# EAGLE design Soccer-Robot V1.2 (EAGLE 9.5.1)

## Sheet 1 of 2
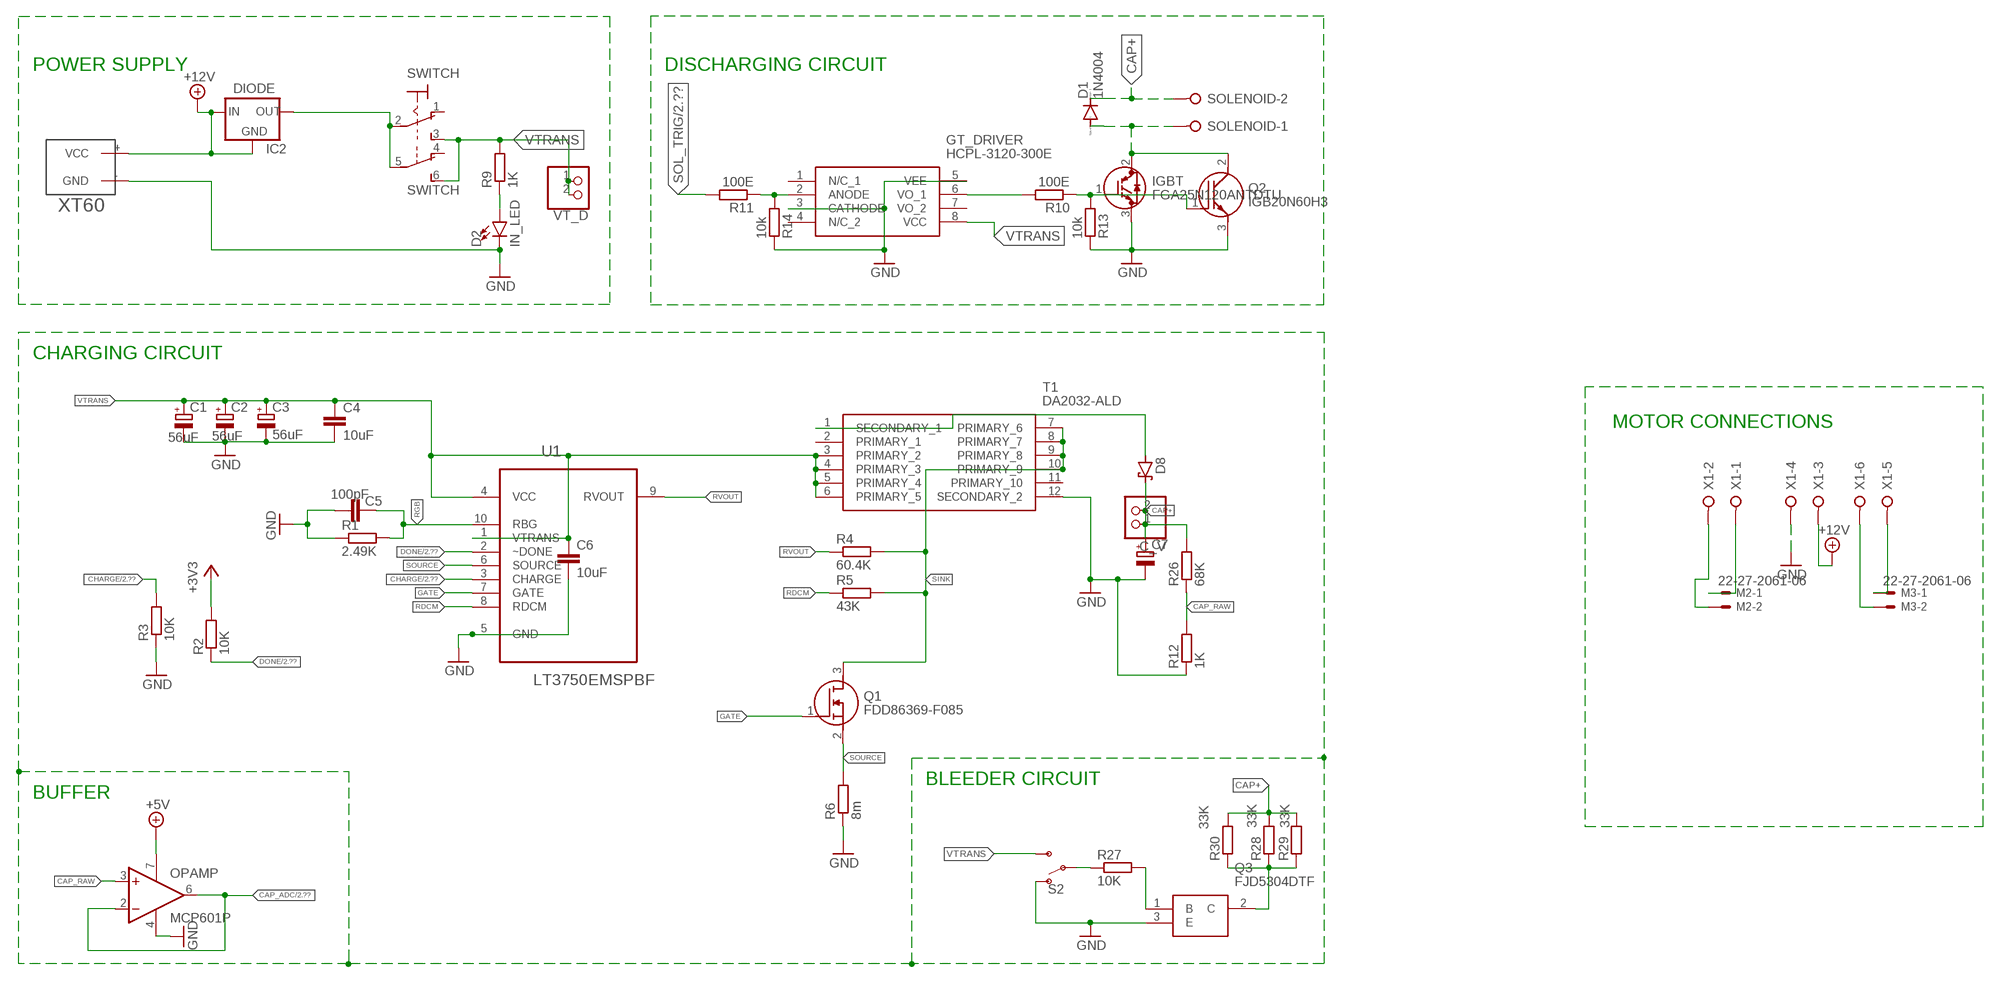
[diagram p0: schematic, sheet 1]

### Parts
C1  56uF  CPOL-EUE2.5-5  [E2,5-5]
C2  56uF  CPOL-EUE2.5-5  [E2,5-5]
C3  56uF  CPOL-EUE2.5-5  [E2,5-5]
C4  10uF  C-EUC1206  [C1206]
C5  100pF  C-EUC1206  [C1206]
C6  10uF  C-EUC1206  [C1206]
C7  CPOL-EUE10-30  [EB30D]
C_V  PINHD-1X2  [1X02]
D1  1N4004  [DO41-10]
D2  IN_LED  LED5MM  [LED_5MM]
D8  SCHOTTKY-DIODESMC  [SMC]
GT_DRIVER  HCPL-3120-300E  [HCPL-3120-GULL-WING]
IC2  DIODE  LM1117TO252  [TO252]
IGBT  FGA25N120ANTDTU  [TO545P500X1560X2420-3P]
M2  22-27-2061-06  [6410-06]
M3  22-27-2061-06  [6410-06]
OPAMP  MCP601P  [DIL08]
Q1  FDD86369-F085  [DPAK3-CASE-369AS]
Q2  IGB20N60H3  [IDB30E60]
Q3  FJD5304DTF  [FJD5304DTF]
R1  2.49K  R-EU_M1206  [M1206]
R2  10K  R-EU_M1206  [M1206]
R3  10K  R-EU_M1206  [M1206]
R4  60.4K  R-EU_M1206  [M1206]
R5  43K  R-EU_M1206  [M1206]
R6  8m  R-EU_M1206  [M1206]
R9  1K  R-EU_M1206  [M1206]
R10  100E  R-EU_M1206  [M1206]
R11  100E  R-EU_M1206  [M1206]
R12  1K  R-EU_M1206  [M1206]
R13  10k  R-EU_M1206  [M1206]
R14  10k  R-EU_M1206  [M1206]
R26  68K  R-EU_M1206  [M1206]
R27  10K  R-EU_M1206  [M1206]
R28  33K  R-EU_M1206  [M1206]
R29  33K  R-EU_M1206  [M1206]
R30  33K  R-EU_M1206  [M1206]
S2  SWITCH-SPDT-PTH-11.6X4.0MM  [SWITCH_SPDT_PTH_11.6X4.0MM]
SOLENOID  W237-02P  [W237-132]
SWITCH  320-938  [320-938]
T1  DA2032-ALD  [SOP250P2197X889-12N]
U1  LT3750EMSPBF  [SOP50P490X110-10N]
U$1  XT60  [XT60]
VT_D  PINHD-1X2  [1X02]
X1  W237-06P  [W237-6P]

### Nets
+3V3: R2.2 ; also sheet 2
+5V: OPAMP.7(V+) ; also sheet 2
+12V: IC2.1(GND) IC2.2(IN) U$1.+(VCC) X1.3 ; also sheet 2
CAP+: C7.+ C_V.1 C_V.2 D1.C D8.C R26.2 R28.2 R29.2 R30.2 SOLENOID.2
CAP_ADC: OPAMP.2(-IN) OPAMP.6(OUT) ; also sheet 2
CAP_RAW: OPAMP.3(+IN) R12.2 R26.1
CHARGE: R3.2 U1.3(CHARGE) ; also sheet 2
DONE: R2.1 U1.2(~DONE) ; also sheet 2
GATE: Q1.1(G) U1.7(GATE)
GND: C1.- C2.- C3.- C4.2 C5.2 C6.2 C7.- D2.K(C) GT_DRIVER.3(CATHODE) GT_DRIVER.5(VEE) IGBT.3(E) OPAMP.4(V-) Q2.3(E) Q3.3(E) R1.1 R3.1 R6.1 R12.1 R13.2 R14.2 S2.1(O) T1.12(SECONDARY_2) U1.5(GND) U$1.-(GND) X1.4 ; also sheet 2
N$2: R27.1 S2.2(P)
N$3: Q3.1(B) R27.2
N$4: D8.A T1.1(SECONDARY_1)
N$7: D2.A R9.1
N$8: IGBT.1(G) Q2.1(G) R10.1 R13.1
N$9: GT_DRIVER.6(VO_1) R10.2
N$10: D1.A IGBT.2(C) Q2.2(C) SOLENOID.1
N$11: GT_DRIVER.2(ANODE) R11.1 R14.1
N$13: M3.1 X1.5
N$15: M3.2 X1.6
N$16: M2.2 X1.2
N$17: M2.1 X1.1
N$23: Q3.2(C) R28.1 R29.1 R30.1
RDCM: R5.1 U1.8(RDCM)
RGB: C5.1 R1.2 U1.10(RBG)
RVOUT: R4.1 U1.9(RVOUT)
SINK: Q1.3(D) R4.2 R5.2 T1.7(PRIMARY_6) T1.8(PRIMARY_7) T1.9(PRIMARY_8) T1.10(PRIMARY_9)
SOL_TRIG: R11.2 ; also sheet 2
SOURCE: Q1.2(S) R6.2 U1.6(SOURCE)
VIN: IC2.3(OUT) SWITCH.2(1:P) SWITCH.5(B:P)
VTRANS: C1.+ C2.+ C3.+ C4.1 C6.1 GT_DRIVER.8(VCC) R9.2 S2.3(S) SWITCH.3(1:S) SWITCH.6(B:S) T1.3(PRIMARY_2) T1.4(PRIMARY_3) T1.5(PRIMARY_4) T1.6(PRIMARY_5) U1.1(VTRANS) U1.4(VCC) VT_D.1 VT_D.2
Unconnected: GT_DRIVER.1(N/C_1) GT_DRIVER.4(N/C_2) GT_DRIVER.7(VO_2) M2.3 M2.4 M2.5 M2.6 M3.3 M3.4 M3.5 M3.6 SWITCH.1(1:O) SWITCH.4(B:O) T1.2(PRIMARY_1) T1.11(PRIMARY_10)

### Notes on the sheet
- POWER SUPPLY | DISCHARGING CIRCUIT
- CHARGING CIRCUIT
- MOTOR CONNECTIONS
- BLEEDER CIRCUIT
- BUFFER

## Sheet 2 of 2
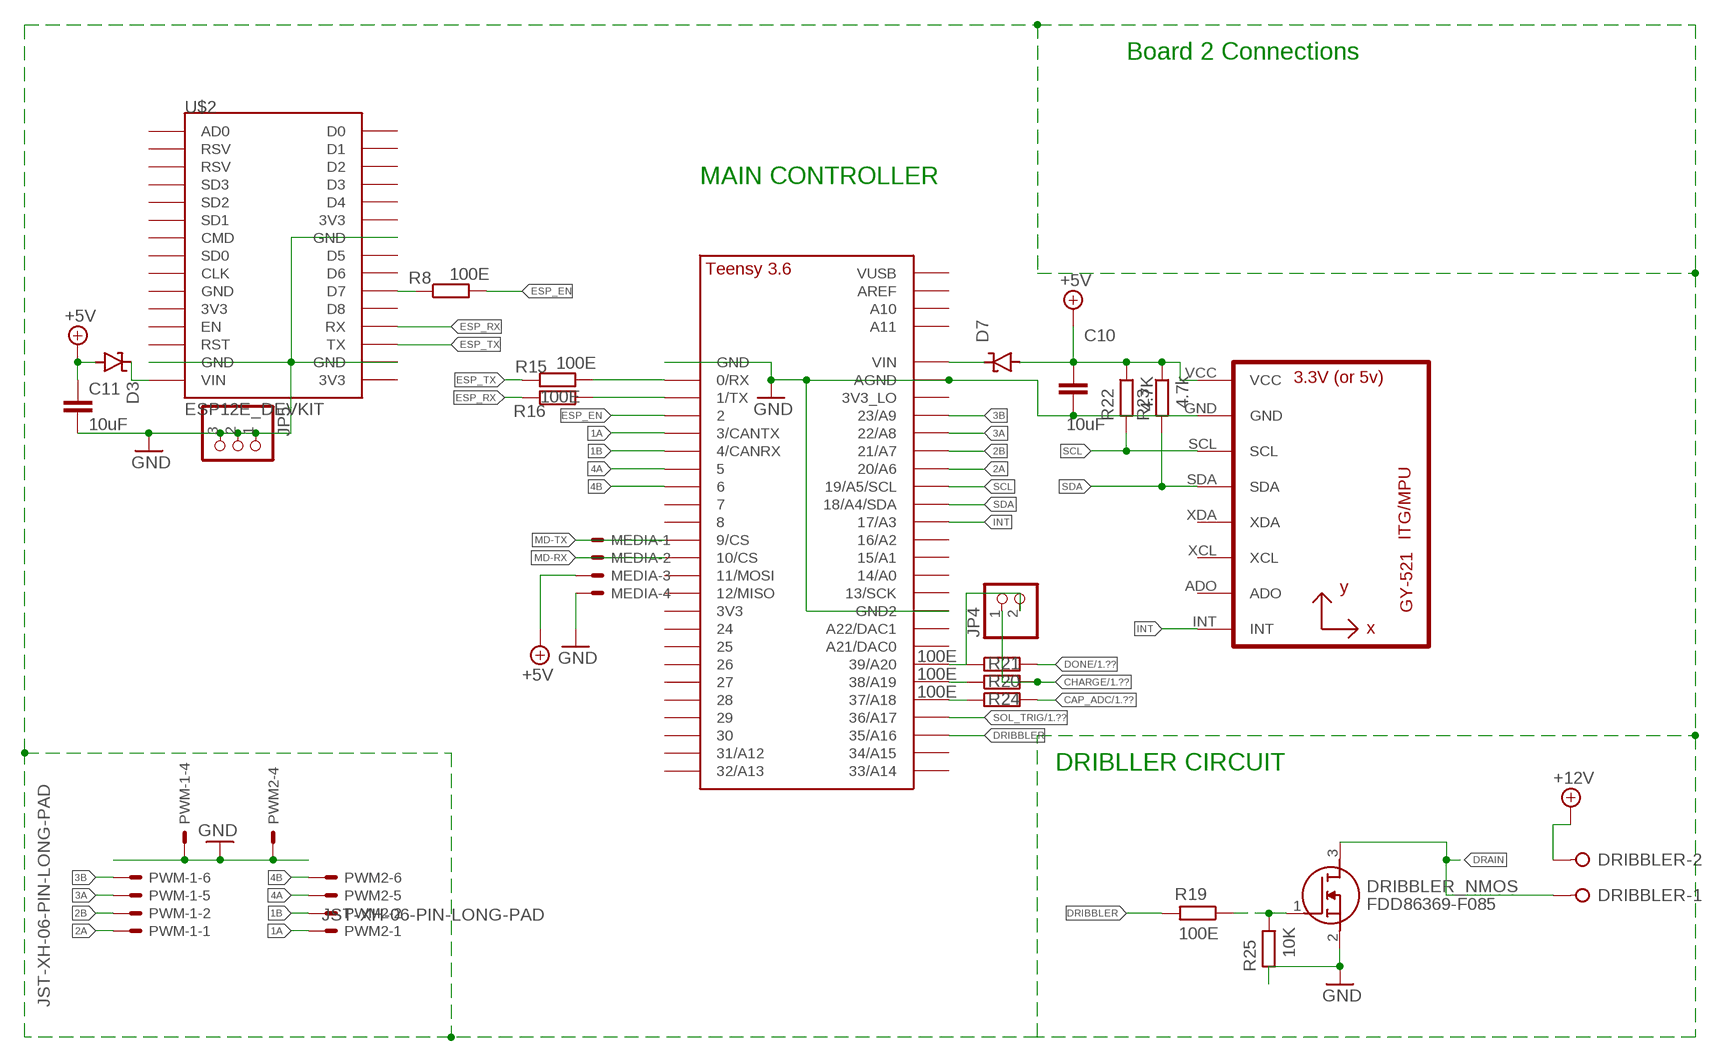
[diagram p1: schematic, sheet 2, part 1 of 2]
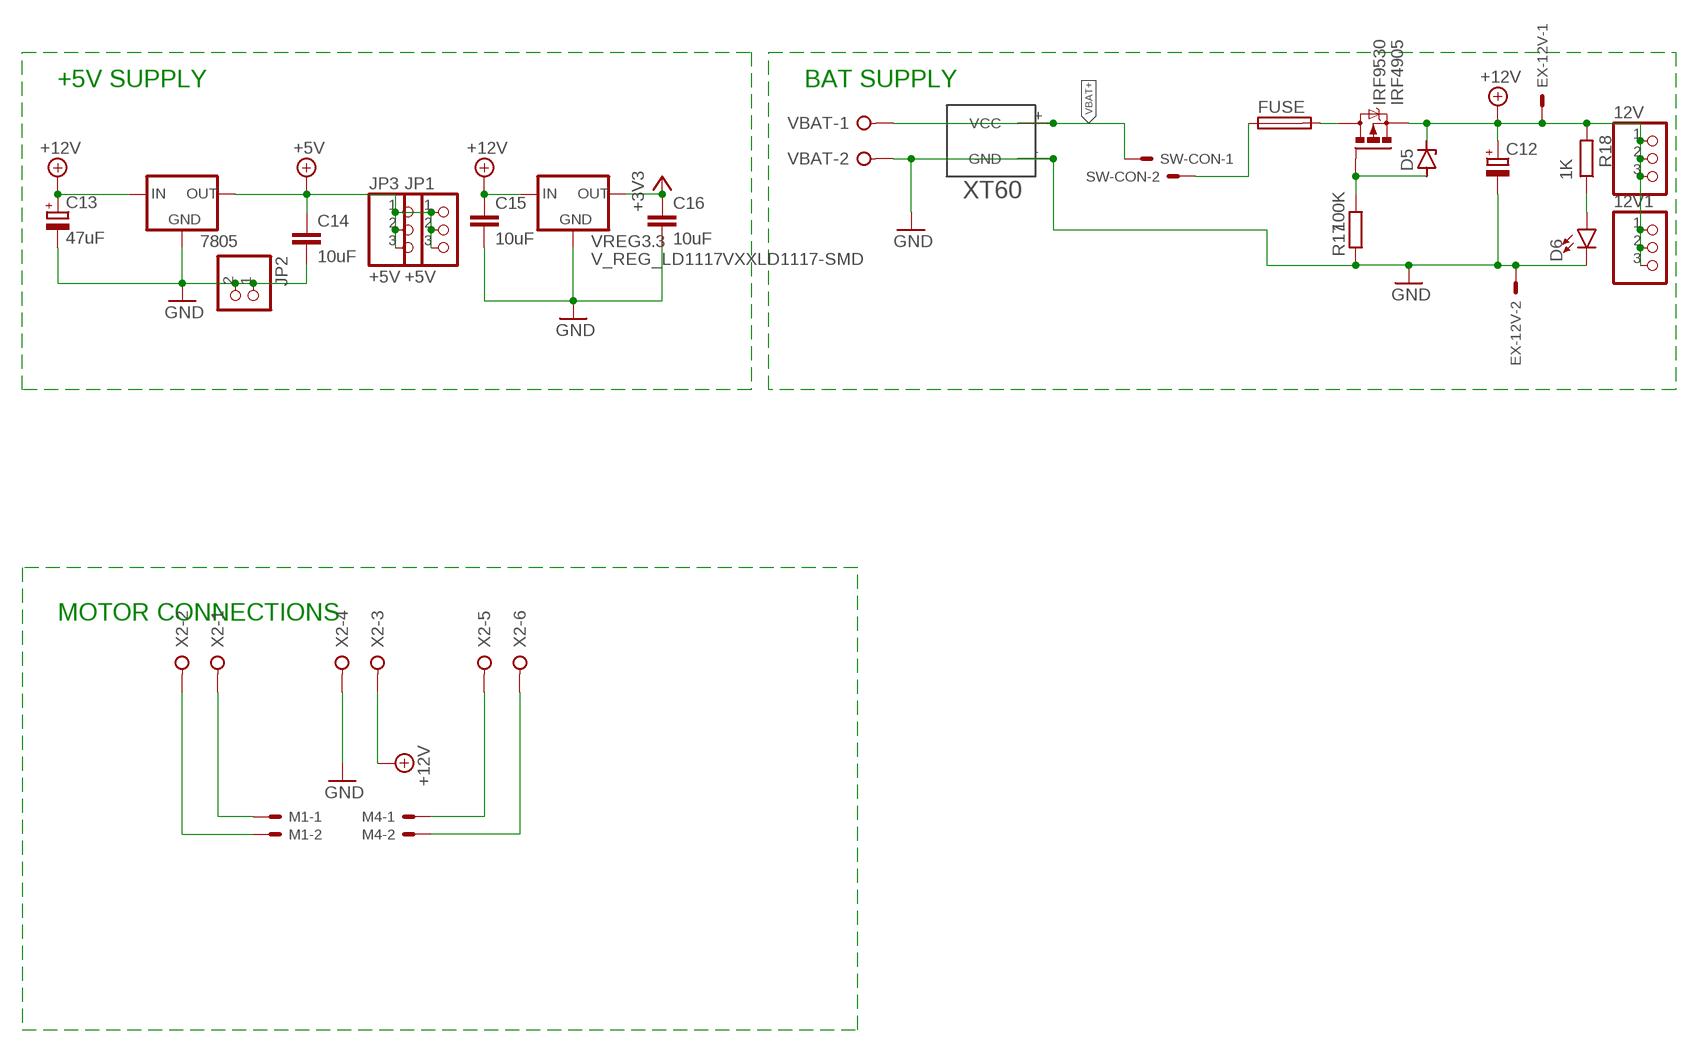
[diagram p2: schematic, sheet 2, part 2 of 2]

### Parts
12V  PINHD-1X3  [1X03]
12V1  PINHD-1X3  [1X03]
7805  78XXS  [78XXS]
C10  10uF  C-EUC1206  [C1206]
C11  10uF  C-EUC1206  [C1206]
C12  CPOL-EUE2.5-7  [E2,5-7]
C13  47uF  CPOL-EUE2.5-7  [E2,5-7]
C14  10uF  C-EUC1206  [C1206]
C15  10uF  C-EUC1206  [C1206]
C16  10uF  C-EUC1206  [C1206]
D3  SUPPRESSOR-SMBG  [SMBG]
D5  ZENER-DIODEDO41Z10  [DO41Z10]
D6  LED5MM  [LED_5MM]
D7  SUPPRESSOR-SMBG  [SMBG]
DRIBBLER  W237-02P  [W237-132]
DRIBBLER_NMOS  FDD86369-F085  [DPAK3-CASE-369AS]
EX-12V  KK-156-2  [KK-156-2]
FUSE  SH22,5A  [SH22,5A]
IRF4905  IRF9530  [TO220BV]
JP1  +5V  PINHD-1X3  [1X03]
JP2  PINHD-1X2  [1X02]
JP3  +5V  PINHD-1X3  [1X03]
JP4  PINHD-1X2  [1X02]
JP5  PINHD-1X3  [1X03]
M1  22-27-2061-06  [6410-06]
M4  22-27-2061-06  [6410-06]
MEDIA  JST-XH-04-PIN-LONG-PAD  [JST-XH-04-PACKAGE-LONG-PAD]
PWM2  JST-XH-06-PIN-LONG-PAD  [JST-XH-06-PACKAGE-LONG-PAD]
PWM-1  JST-XH-06-PIN-LONG-PAD  [JST-XH-06-PACKAGE-LONG-PAD]
R8  100E  R-EU_M1206  [M1206]
R15  100E  R-EU_M1206  [M1206]
R16  100E  R-EU_M1206  [M1206]
R17  100K  R-EU_M1206  [M1206]
R18  1K  R-EU_M1206  [M1206]
R19  100E  R-EU_M1206  [M1206]
R20  100E  R-EU_M1206  [M1206]
R21  100E  R-EU_M1206  [M1206]
R22  4.7K  R-EU_M1206  [M1206]
R23  4.7k  R-EU_M1206  [M1206]
R24  100E  R-EU_M1206  [M1206]
R25  10K  R-EU_M1206  [M1206]
SW-CON  KK-156-2  [KK-156-2]
U2  GY-521MPU6050  [GY-521]
U$2  ESP12E_DEVKIT  [ESP12E_DEVKIT]
U$3  TEENSY_3.5/3.6_BASIC  [TEENSY_3.5/3.6_BASIC]
VBAT  W237-02P  [W237-132]
VBAT2  XT60  [XT60]
VREG3.3  V_REG_LD1117VXXLD1117-SMD  [SOT223]
X2  W237-06P  [W237-6P]

### Nets
1A: PWM2.1 U$3.3/CANTX
1B: PWM2.2 U$3.4/CANRX
2A: PWM-1.1 U$3.20/A6
2B: PWM-1.2 U$3.21/A7
3A: PWM-1.5 U$3.22/A8
3B: PWM-1.6 U$3.23/A9
4A: PWM2.5 U$3.5
4B: PWM2.6 U$3.6
+3V3: C16.1 VREG3.3.2(OUT) VREG3.3.4(OUT) ; also sheet 1
+5V: 7805.OUT C10.1 C11.1 C14.1 D3.A D7.A JP1.1 JP1.2 JP1.3 JP3.1 JP3.2 JP3.3 MEDIA.3 R22.1 R23.1 U2.VCC ; also sheet 1
+12V: 12V1.1 12V1.2 12V1.3 12V.1 12V.2 12V.3 7805.IN C12.+ C13.+ C15.1 D5.C DRIBBLER.2 EX-12V.1 IRF4905.S R18.2 VREG3.3.3(IN) X2.3 ; also sheet 1
CAP_ADC: R24.2 ; also sheet 1
CHARGE: JP4.1 R20.2 ; also sheet 1
DONE: R21.2 ; also sheet 1
DRAIN: DRIBBLER.1 DRIBBLER_NMOS.3(D)
DRIBBLER: R19.2 U$3.35/A16
ESP_EN: R8.2 U$3.2
ESP_RX: R16.1 U$2.RX
ESP_TX: R15.1 U$2.TX
GND: 7805.GND C10.2 C11.2 C12.- C13.- C14.2 C15.2 C16.2 D6.K(C) DRIBBLER_NMOS.2(S) EX-12V.2 JP2.1 JP2.2 JP5.1 JP5.2 JP5.3 MEDIA.4 PWM2.4 PWM-1.4 R17.1 R25.2 U2.GND U$2.GND@1(GND) U$2.GND@2(GND) U$2.GND@3(GND) U$3.AGND U$3.GND U$3.GND2 VBAT2.-(GND) VBAT.2 VREG3.3.1(GND) X2.4 ; also sheet 1
INT: U2.INT U$3.17/A3
MD-RX: MEDIA.2 U$3.10/CS
MD-TX: MEDIA.1 U$3.9/CS
N$14: R8.1 U$2.D7
N$19: R15.2 U$3.0/RX
N$20: R16.2 U$3.1/TX
N$24: FUSE.2 IRF4905.D
N$25: D5.A IRF4905.G R17.2
N$26: D6.A R18.1
N$27: DRIBBLER_NMOS.1(G) R19.1 R25.1
N$29: M4.1 X2.5
N$30: M4.2 X2.6
N$31: M1.1 X2.1
N$33: R20.1 U$3.38/A19
N$34: JP4.2 R21.1 U$3.39/A20
N$35: R24.1 U$3.37/A18
N$36: D3.C U$2.VIN
N$70: M1.2 X2.2
N$72: FUSE.1 SW-CON.2
N$75: D7.C U$3.VIN
SCL: R22.2 U2.SCL U$3.19/A5/SCL
SDA: R23.2 U2.SDA U$3.18/A4/SDA
SOL_TRIG: U$3.36/A17 ; also sheet 1
VBAT+: SW-CON.1 VBAT2.+(VCC) VBAT.1
Unconnected: M1.3 M1.4 M1.5 M1.6 M4.3 M4.4 M4.5 M4.6 PWM2.3 PWM-1.3 U2.ADO U2.XCL U2.XDA U$2.3V3@0(3V3) U$2.3V3@1(3V3) U$2.3V3@2(3V3) U$2.AD0 U$2.CLK U$2.CMD U$2.D0 U$2.D1 U$2.D2 U$2.D3 U$2.D4 U$2.D5 U$2.D6 U$2.D8 U$2.EN U$2.GND@0(GND) U$2.RST U$2.RSV@0(RSV) U$2.RSV@1(RSV) U$2.SD0 U$2.SD1 U$2.SD2 U$2.SD3 U$3.3V3 U$3.3V3_LO U$3.7 U$3.8 U$3.11/MOSI U$3.12/MISO U$3.13/SCK U$3.14/A0 U$3.15/A1 U$3.16/A2 U$3.21/DAC0(A21/DAC0) U$3.24 U$3.25 U$3.26 U$3.27 U$3.28 U$3.29 U$3.30 U$3.31/A12 U$3.32/A13 U$3.33/A14 U$3.34/A15 U$3.A10 U$3.A11 U$3.A22/DAC1 U$3.AREF U$3.VUSB

### Notes on the sheet
- Board 2 Connections
- +5V SUPPLY | BAT SUPPLY
- MAIN CONTROLLER
- MOTOR CONNECTIONS
- DRIBLLER CIRCUIT

## Library data of the parts
12V 12V1 JP1 JP3 JP5 = pinhead:PINHD-1X3: PIN HEADER
7805 = v-reg:78XXS: VOLTAGE REGULATOR
C1-C3 C7 C12 C13 = rcl:CPOL-EU: POLARIZED CAPACITOR, European symbol; SPICEPREFIX: C
C4-C6 C10 C11 C14-C16 = rcl:C-EU: CAPACITOR, European symbol; SPICEPREFIX: C
C_V JP2 JP4 VT_D = pinhead:PINHD-1X2: PIN HEADER
D1 = diode:1N4004: DIODE general purpose rectifier, 1 A
D2 D6 = SparkFun-LED:LED: LED (Generic) Standard schematic elements and footprints for 5mm, 3mm, 1206, and 0603 sized LEDs. Generic LEDs with no color specified.
D3 D7 = diode:SUPPRESSOR-: Suppressor diode
D5 = diode:ZENER-DIODE: Z-Diode
D8 = diode:SCHOTTKY-DIODE: Schottky Diode
DRIBBLER SOLENOID VBAT = con-wago-508:W237-02P: WAGO SREW CLAMP; OC_FARNELL: unknown; OC_NEWARK: unknown
DRIBBLER_NMOS Q1 = FDD86369-F085:FDD86369-F085: MOSFET 80V 90A Dual DPAK N-Chnl PowerTrench Source: Datasheet <https://componentsearchengine.com/Datasheets/1/FDD86369-F085.pdf>; DESCRIPTION: MOSFET 80V 90A Dual DPAK N-Chnl PowerTrench; HEIGHT: mm; MANUFACTURER_NAME: ON Semiconductor; MANUFACTURER_PART_NUMBER: FDD86369-F085; MOUSER_PART_NUMBER: 512-FDD86369_F085; MOUSER_PRICE-STOCK: https://www.mouser.com/Search/Refine.aspx?Keyword=512-FDD86369_F085
EX-12V SW-CON = con-molex:KK-156-2: KK 156 HEADER Source: http://www.molex.com/pdm_docs/sd/026604100_sd.pdf; MF: MOLEX; OC_FARNELL: unknown; OC_NEWARK: unknown
FUSE = fuse:SH22,5A: FUSE HOLDER grid 22,5mm, isolated cap OGN0031 8201, Schurter (Buerklin); MPN: 0031.7701.11; OC_FARNELL: unknown; OC_NEWARK: 04F1224
GT_DRIVER = HCPL-3120-300E:HCPL-3120-300E: Logic Output Optocouplers 2.0A IGBT Gate Drive Source: Datasheet; DESCRIPTION: Logic Output Optocouplers 2.0A IGBT Gate Drive; HEIGHT: mm; MANUFACTURER_NAME: Avago Technologies; MANUFACTURER_PART_NUMBER: HCPL-3120-300E; MOUSER_PART_NUMBER: 630-HCPL-3120-300E; MOUSER_PRICE-STOCK: https://www.mouser.com/Search/Refine.aspx?Keyword=630-HCPL-3120-300E
IC2 = v-reg-2:LM1117
IGBT = FGA25N120ANTDTU:FGA25N120ANTDTU: IGBT N-Ch 1200V 50A NPT Trench TO3PN Fairchild FGA25N120ANTDTU, 50 A 1200 V, 1MHz, 3-Pin TO-3P Source: Datasheet <https://componentsearchengine.com/Datasheets/1/FGA25N120ANTDTU.pdf>; DESCRIPTION: IGBT N-Ch 1200V 50A NPT Trench TO3PN Fairchild FGA25N120ANTDTU, 50 A 1200 V, 1MHz, 3-Pin TO-3P; HEIGHT: 5mm; MANUFACTURER_NAME: ON Semiconductor; MANUFACTURER_PART_NUMBER: FGA25N120ANTDTU; MOUSER_PART_NUMBER: 512-FGA25N120ANTDTU; MOUSER_PRICE-STOCK: https://www.mouser.com/Search/Refine.aspx?Keyword=512-FGA25N120ANTDTU
IRF4905 = transistor-power:IRF9530: P-CHANNEL HEXFET POWER-MOS-FET Source: http://www.irf.com/product-info/datasheets/data/irf9530.pdf
M1-M4 = con-molex:22-?-06: CONNECTOR wire to board 2.54 mm (.1 inch) pitch header; MF: MOLEX; OC_FARNELL: unknown; OC_NEWARK: unknown
MEDIA = Rembrandt Electronics - JST XH Connectors v1-0:JST-XH-04-PIN: JST XH Connector 2 Pin Wire to board connector. Pitch: 2,54 mm, (0.100") Number of pins: 4 Created by Rembrandt Electronics www.rembrandtelectronics.com
OPAMP = linear:MCP601: Single Op Amp 2.7V to 6.0V Single Supply CMOS Source: http://ww1.microchip.com/downloads/en/DeviceDoc/21314g.pdf
PWM2 PWM-1 = Rembrandt Electronics - JST XH Connectors v1-0:JST-XH-06-PIN: JST XH Connector 2 Pin Wire to board connector. Pitch: 2,54 mm, (0.100") Number of pins: 6 Created by Rembrandt Electronics www.rembrandtelectronics.com
Q2 = IGB20N60H3:IGB20N60H3: IGBT Transistors 600v Hi-Speed SW IGBT Source: Datasheet <https://componentsearchengine.com/Datasheets/1/IGB20N60H3.pdf>; DESCRIPTION: IGBT Transistors 600v Hi-Speed SW IGBT; HEIGHT: 4mm; MANUFACTURER_NAME: Infineon; MANUFACTURER_PART_NUMBER: IGB20N60H3; MOUSER_PART_NUMBER: 726-IGB20N60H3; MOUSER_PRICE-STOCK: https://www.mouser.com/Search/Refine.aspx?Keyword=726-IGB20N60H3
Q3 = FJD5304DTF:FJD5304DTF: ON Semi FJD5304DTF NPN Transistor, 4 A, 400 V, 3-Pin DPAK Source: Datasheet <https://componentsearchengine.com/Datasheets/1/FJD5304DTF.pdf>; DESCRIPTION: ON Semi FJD5304DTF NPN Transistor, 4 A, 400 V, 3-Pin DPAK; HEIGHT: 2.285mm; MANUFACTURER_NAME: ON Semiconductor; MANUFACTURER_PART_NUMBER: FJD5304DTF; MOUSER_PART_NUMBER: 512-FJD5304DTF; MOUSER_PRICE-STOCK: https://www.mouser.com/Search/Refine.aspx?Keyword=512-FJD5304DTF
R1-R6 R8-R30 = rcl:R-EU_: RESISTOR, European symbol; SPICEPREFIX: R
S2 = SparkFun-Switches:SWITCH-SPDT: Single Pole, Double Throw (SPDT) Switch Single-pole, double-throw (SPDT) switch. Variant Overview SMD-AYZ0202 Surface Mount DPDT Switch <https://www.sparkfun.com/products/597> (COM-00597) Used on e.g. LilyPad Arduino USB - ATmega32U4 Board <https://www.sparkfun.com/products/12049> PTH-11.6X4.0MM SPDT Mini Power Switch <https://www.sparkfun.com/products/102> (COM-00102) Used on e.g. SparkFun Simon Says - Through-Hole Soldering Kit <https://www.sparkfun.com/products/10547> (KIT-10547) PTH-11.6X4.0MM-KIT KIT version of SPDT Mini Power Switch - Simplifies soldering by removing tStop of switch pins - only one side can be soldered. PTH-11.6X4.0MM-LOCK LOCK version of SPDT Mini Power Switch - Offset pins hold switch in place for easier soldering. SMD-RIGHT-ANGLE Surface Mount Right Angle Switch <https://www.sparkfun.com/products/10860> (COM-10860) Used on e.g. SparkFun ESP8266 Thing <https://www.sparkfun.com/products/13231>; PROD_ID: SWCH-08261; SF_SKU: COM-00102
SWITCH = switch:320-938: TOGGLE SWITCH distributor RS Components
T1 = DA2032ALD:DA2032-ALD: COILCRAFT - DA2032-ALD - TRANSFORMER, FLYBACK, LT3750, SMD Source: Datasheet <https://componentsearchengine.com/Datasheets/1/DA2032-ALD.pdf>; DESCRIPTION: COILCRAFT - DA2032-ALD - TRANSFORMER, FLYBACK, LT3750, SMD; HEIGHT: 8.89mm; MANUFACTURER_NAME: COILCRAFT; MANUFACTURER_PART_NUMBER: DA2032-ALD; MOUSER_PART_NUMBER: 994-DA2032-ALD; MOUSER_PRICE-STOCK: https://www.mouser.com/Search/Refine.aspx?Keyword=994-DA2032-ALD
U1 = LT3750-element14:LT3750EMSPBF: Capacitor Charger Controller; MPN: LT3750EMS#PBF; OC_FARNELL: 1273500; OC_NEWARK: 57M8591; PACKAGE: MSOP-10; SUPPLIER: Linear Technology
U2 = gy-521:GY-521
U$1 VBAT2 = XT60:XT60: XT60
U$2 = ESP12E_DEVKIT:ESP12E_DEVKIT: ESP12E DEVKIT BOARD
U$3 = Teensy356:TEENSY_3.5/3.6_BASIC
VREG3.3 = SparkFun-IC-Power:V_REG_LD1117VXX: LD1117VXX voltage regulator. We carry the 3.3V version (COM-00526) in TO-220 package.; PROD_ID: VREG-13917
X1 X2 = con-wago-508:W237-06P: WAGO SREW CLAMP; OC_FARNELL: unknown; OC_NEWARK: unknown

## Board
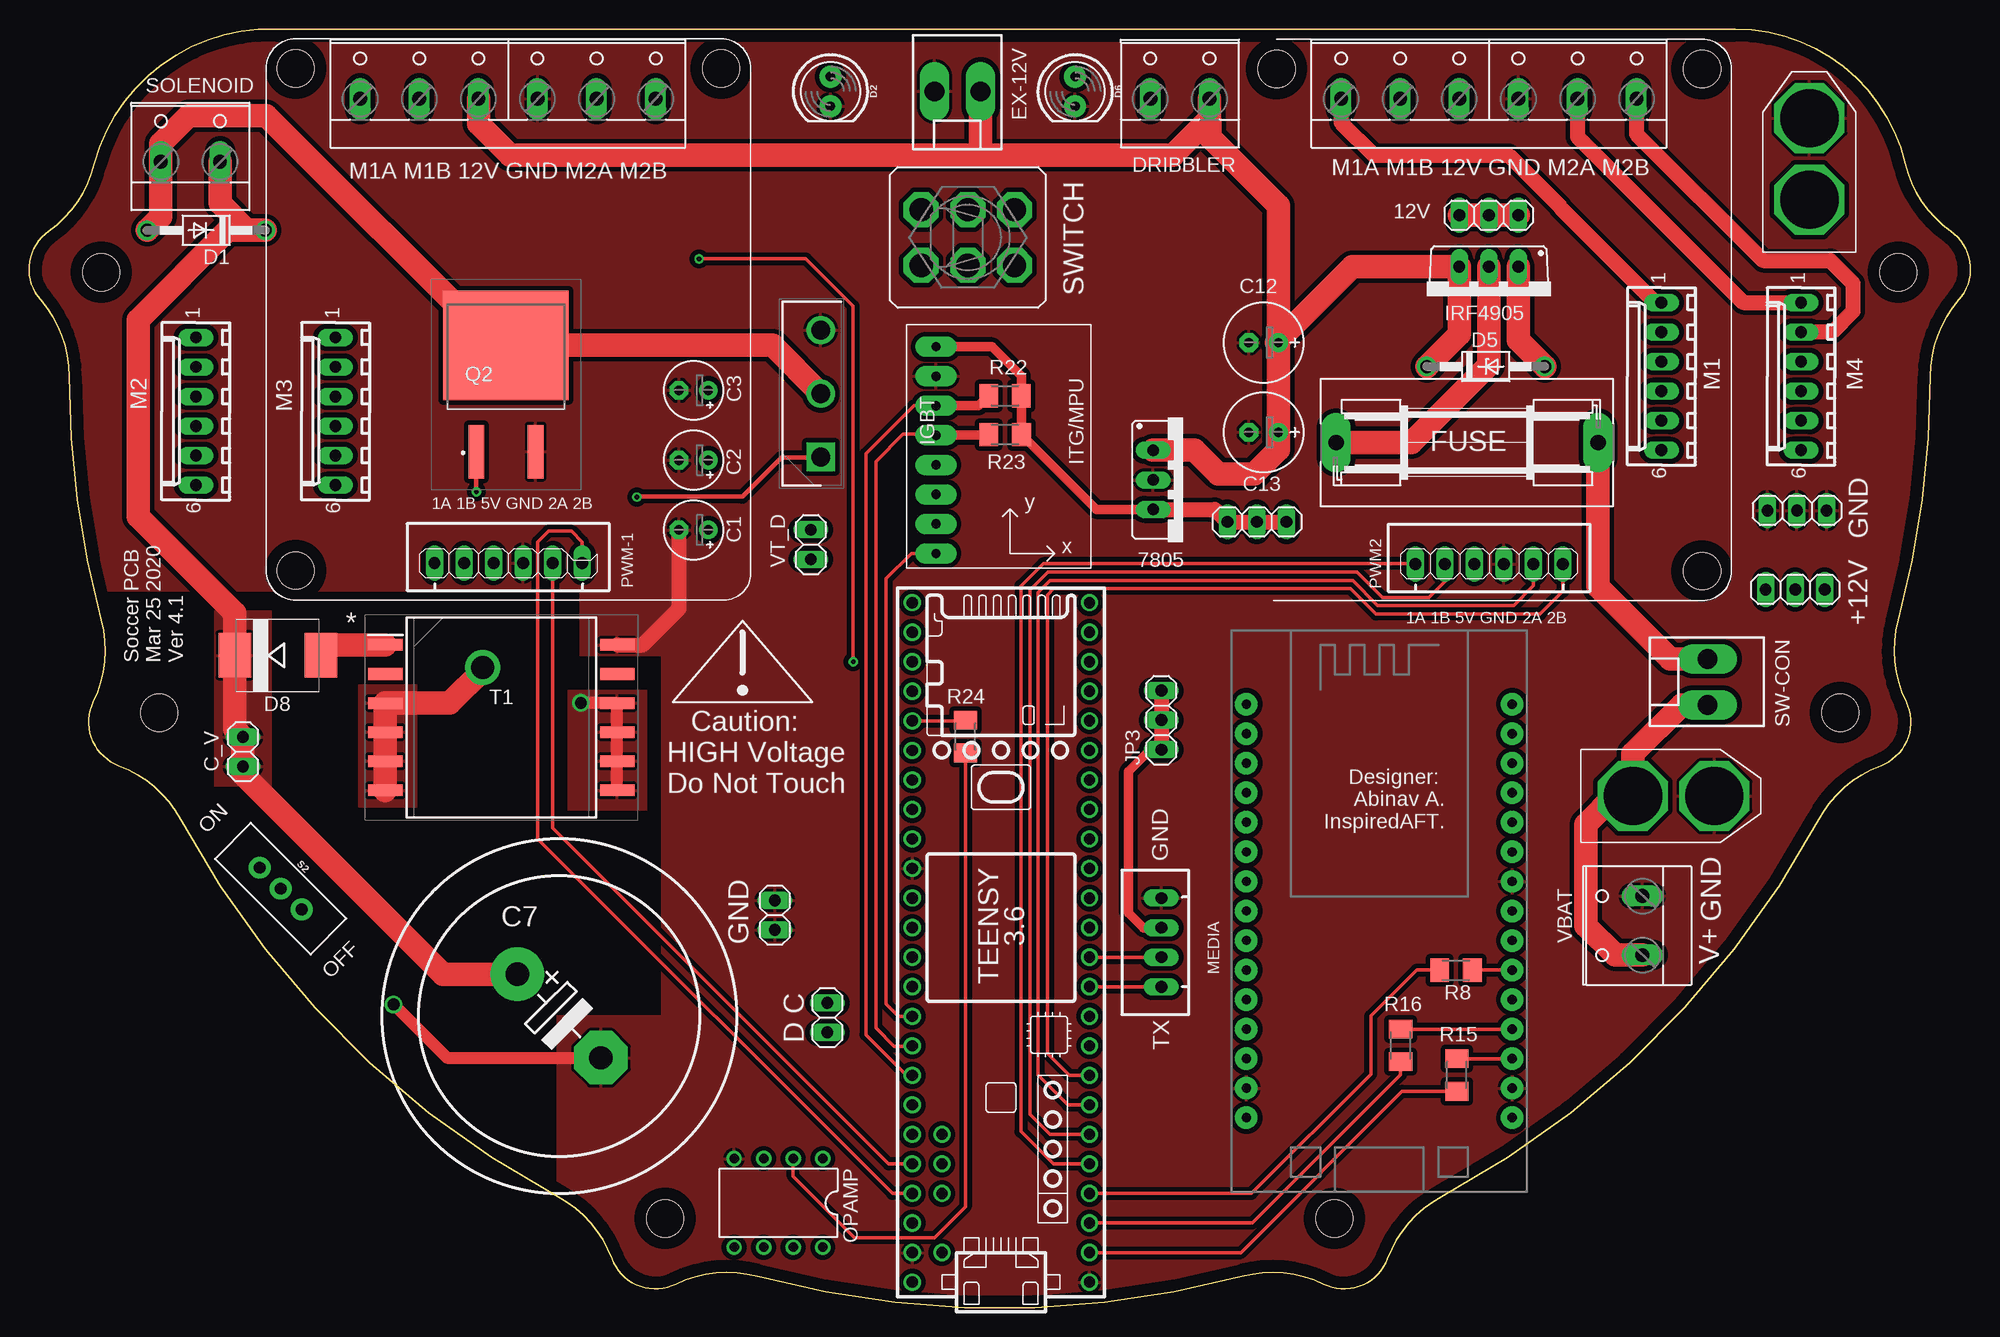
[diagram p3: board, top side]
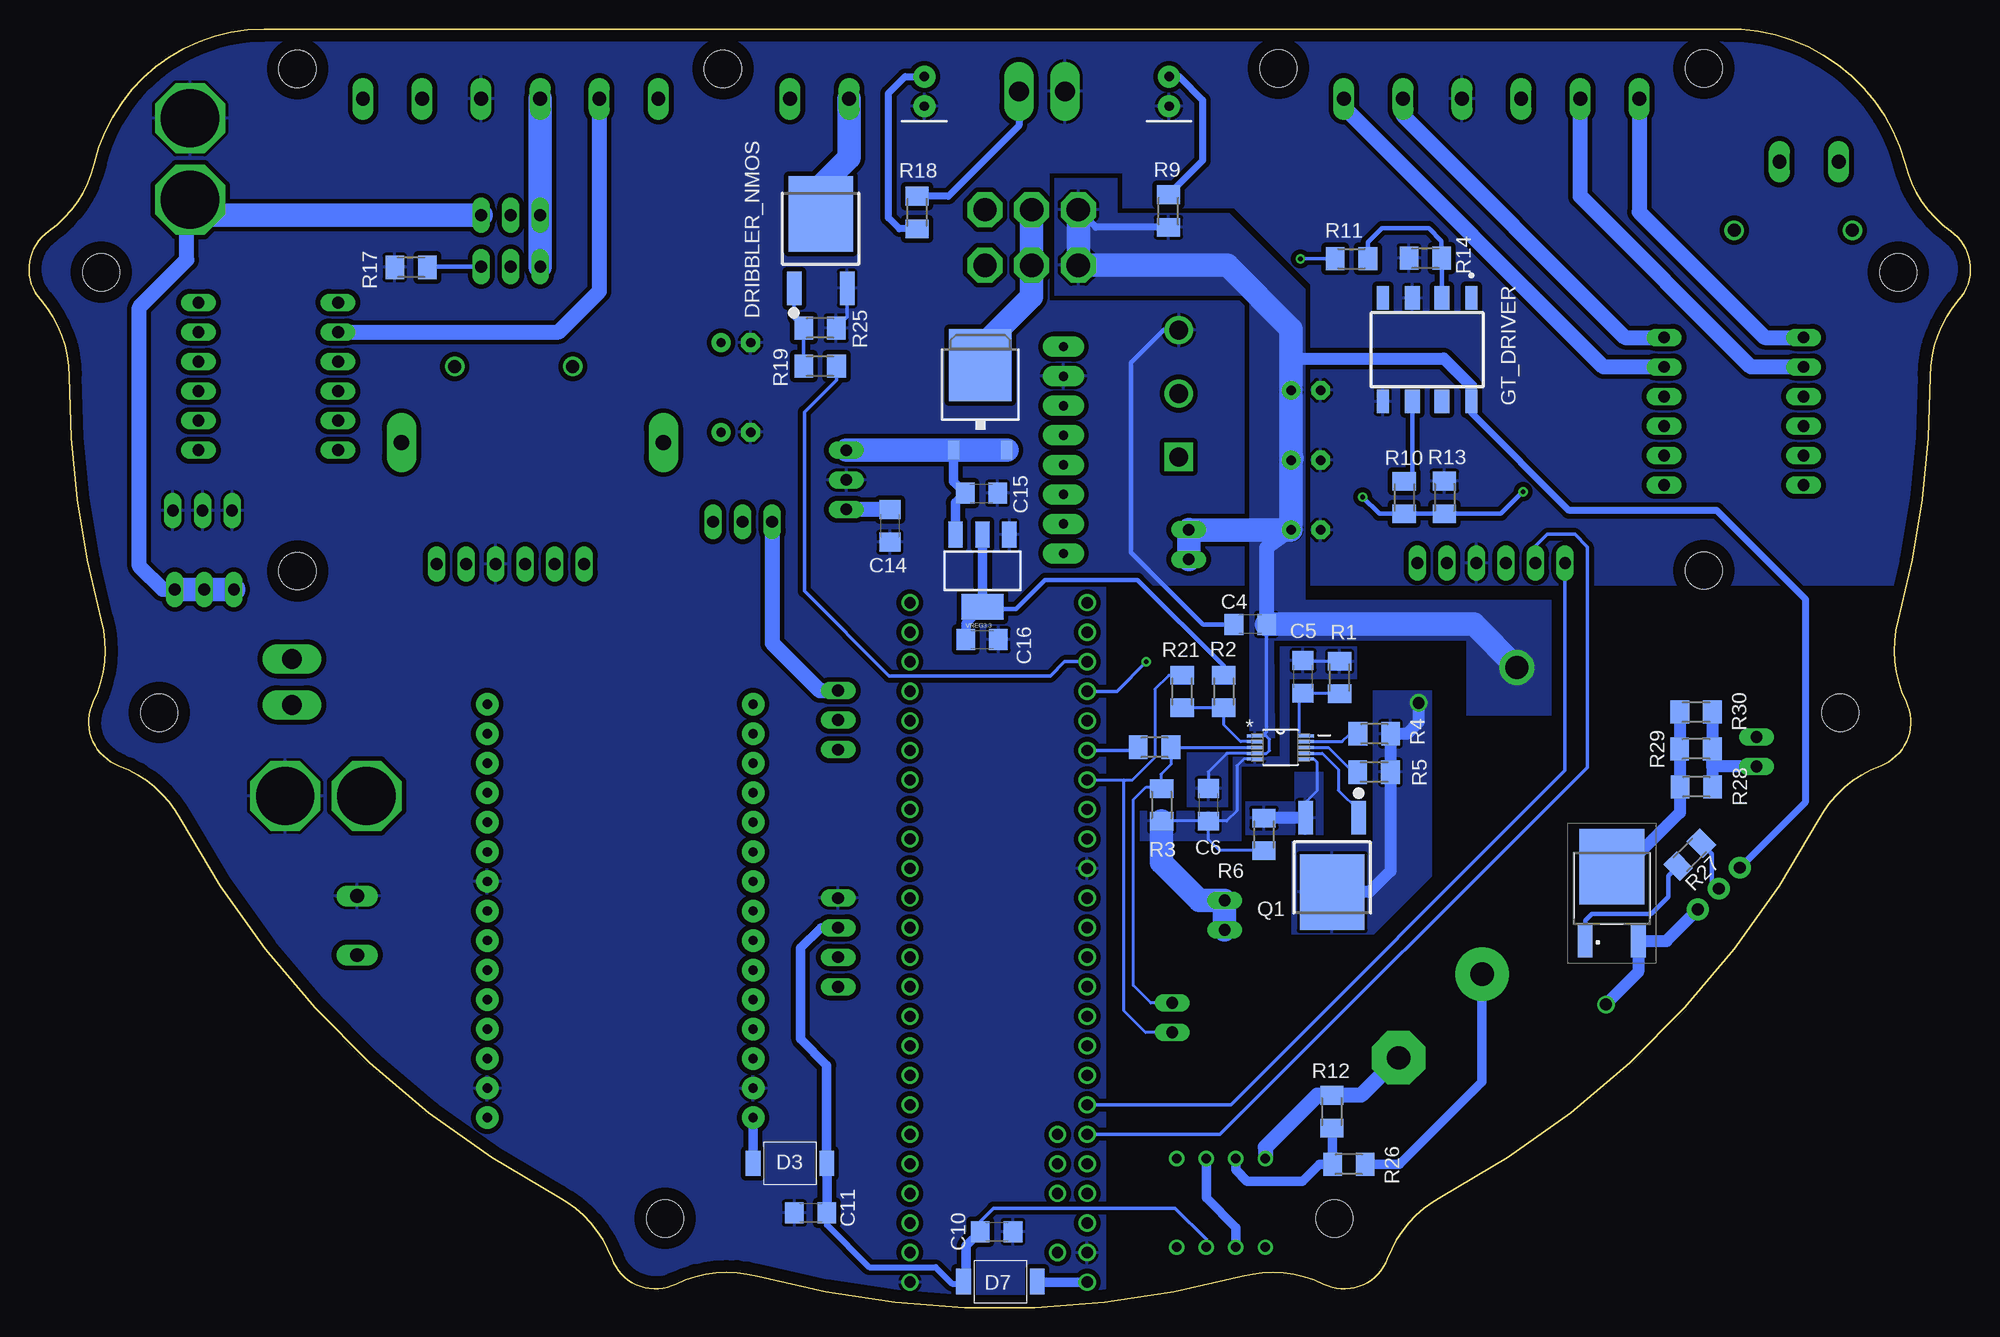
[diagram p4: board, bottom side, seen from below]

Size 166.9 x 109.94 mm. Coordinates in mm from the lower left corner, seen from the top.
Outline: 21.21,109.94 146.7,109.94 arc-77 161.29,98.39 arc41 165.22,92.55 arc-96 165.92,86.66 arc41 163.45,80.07 arc-15 160.69,59.12 arc41 161.37,52.11 arc-96 159.17,46.6 arc41 153.87,41.98 arc-33 121.41,9.53 arc41 116.79,4.22 arc-96 111.28,2.03 arc41 104.28,2.7 arc-30 62.62,2.7 arc41 55.62,2.03 arc-96 50.11,4.22 arc41 45.49,9.53 arc-33 13.03,41.98 arc41 7.73,46.6 arc-96 5.53,52.11 arc41 6.21,59.12 arc-15 3.45,80.07 arc41 0.98,86.66 arc-96 1.68,92.55 arc41 5.61,98.39 arc-77 21.21,109.94
Copper layers (1*16): Top 0.035mm / dielectric 1.5mm / Bottom 0.035mm
Design rules "default": minimum track width 6mil, minimum drill 0.35mm, track to track 6mil, track to pad 6mil, pad to pad 6mil, via to via 6mil, smd to smd 6mil, copper to edge 40mil, drill to drill 6mil, minimum pad ring 10mil, minimum via ring 8mil, stop-mask expansion 4mil, vias tented up to drill 0mil, thermal gap 10mil
Holes 3.2 mm at 143.82,106.52 107.25,106.52 22.92,106.57 54.68,7.68 11.19,51.17 22.92,63.39 6.21,89.03 112.22,7.68 143.82,63.34 155.71,51.17 160.69,89.03 59.49,106.57

### Footprints (pad centres in the part's own frame; a part is rotated, then mirrored left to right if it is on the bottom)
1X03 = drill 1.016 long: 1 -2.54,0; 2 0,0; 3 2.54,0
78XXS = drill 1.016 long: GND 0,-2.54; IN -2.54,-2.54; OUT 2.54,-2.54
E2,5-5 = drill 0.813 pad 1.6: + -1.27,0 | drill 0.813 pad 1.6 octagon: - 1.27,0
C1206 = smd 1.6 x 1.8: 1 -1.4,0; 2 1.4,0
EB30D = drill 2.007 pad 4.597: + -5.08,0 | drill 2.007 pad 4.597 octagon: - 5.08,0
E2,5-7 = drill 0.813 pad 1.6: + -1.27,0 | drill 0.813 pad 1.6 octagon: - 1.27,0
1X02 = drill 1.016 long: 1 -1.27,0; 2 1.27,0
DO41-10 = drill 1.118: A 5.08,0; C -5.08,0
LED_5MM = drill 0.813 pad 1.88: A -1.27,0; K 1.27,0
SMBG = smd 1.27 x 2.16: A 3.17,0; C -3.17,0
DO41Z10 = drill 1.118: A 5.08,0; C -5.08,0
SMC = smd 2.8 x 3.8: A 3.7,0; C -3.7,0
W237-132 = drill 1.194 long: 1 -2.54,-0.635; 2 2.54,-0.635
DPAK3-CASE-369AS = smd 1.25 x 2.85: 1 -2.28,-6.4; 2 2.28,-6.4 | smd 5.55 x 6.5: 3 0,0
KK-156-2 = drill 1.7 pad 2.184 long: 1 -1.98,0; 2 1.98,0
SH22,5A = drill 1.321 pad 2.54 long: 1 -11.252,0; 2 11.252,0
HCPL-3120-GULL-WING = smd 1.016 x 2: 1 -3.81,-4.45; 4 3.81,-4.45; 5 3.81,4.45; 8 -3.81,4.45 | smd 1.27 x 2: 2 -1.27,-4.45; 3 1.27,-4.45; 6 1.27,4.45; 7 -1.27,4.45
TO252 = smd 1 x 1.6: 1 -2.28,-6.07; 2 2.28,-6.07 | smd 5.4 x 6.2: 3 0,1.23
TO545P500X1560X2420-3P = drill 1.62 pad 2.43 square: 1 0,0 | drill 1.62 pad 2.43: 2 5.45,0; 3 10.9,0
TO220BV = drill 1.016 long: D 0,-2.54; G -2.54,-2.54; S 2.54,-2.54
6410-06 = drill 1.016 long: 1 6.35,0; 2 3.81,0; 3 1.27,0; 4 -1.27,0; 5 -3.81,0; 6 -6.35,0
JST-XH-04-PACKAGE-LONG-PAD = drill 1.016 long: 1 -3.81,0; 2 -1.27,0; 3 1.27,0; 4 3.81,0
DIL08 = drill 0.813 pad 1.27: 1 -3.81,-3.81; 2 -1.27,-3.81; 3 1.27,-3.81; 4 3.81,-3.81; 5 3.81,3.81; 6 1.27,3.81; 7 -1.27,3.81; 8 -3.81,3.81
JST-XH-06-PACKAGE-LONG-PAD = drill 1.016 long: 1 -6.35,0; 2 -3.81,0; 3 -1.27,0; 4 1.27,0; 5 3.81,0; 6 6.35,0
IDB30E60 = smd 4.6 x 1.35: 1 6.315,-2.55; 3 6.315,2.55 | smd 9.4 x 10.8: 2 -2.835,0
FJD5304DTF = smd 1.25 x 2.85: 1 -2.28,-4.112; 3 2.28,-4.112 | smd 5.55 x 6.5: 2 0,2.288
M1206 = smd 1.6 x 2: 1 -1.4,0; 2 1.4,0
SWITCH_SPDT_PTH_11.6X4.0MM = drill 1.016 pad 1.88: 1 0,2.54; 2 0,0; 3 0,-2.54
320-938 = drill 2.007 octagon: 1 -2.388,4.013; 2 -2.388,0; 3 -2.388,-4.013; 4 2.388,4.013; 5 2.388,0; 6 2.388,-4.013
SOP250P2197X889-12N = smd 2.95 x 1: 1 -9.975,6.25; 2 -9.975,3.75; 3 -9.975,1.25; 4 -9.975,-1.25; 5 -9.975,-3.75; 6 -9.975,-6.25; 7 9.975,-6.25; 8 9.975,-3.75; 9 9.975,-1.25; 10 9.975,1.25; 11 9.975,3.75; 12 9.975,6.25
SOP50P490X110-10N = smd 1.397 x 0.279: 1 -2.184,0.991; 2 -2.184,0.508; 3 -2.184,0; 4 -2.184,-0.508; 5 -2.184,-0.991; 6 2.184,-0.991; 7 2.184,-0.508; 8 2.184,0; 9 2.184,0.508; 10 2.184,0.991
GY-521 = drill 0.8 pad 1.778 long: ADO -8.89,-6.35; GND -8.89,6.35; INT -8.89,-8.89; SCL -8.89,3.81; SDA -8.89,1.27; VCC -8.89,8.89; XCL -8.89,-3.81; XDA -8.89,-1.27
XT60 = drill 5 octagon: + 4.5,0; - 11.5,0
ESP12E_DEVKIT = drill 0.8 pad 1.93: 3V3@0 -11.43,-7.62; 3V3@1 11.43,5.08; 3V3@2 11.43,-17.78; AD0 -11.43,17.78; CLK -11.43,-2.54; CMD -11.43,2.54; D0 11.43,17.78; D1 11.43,15.24; D2 11.43,12.7; D3 11.43,10.16; D4 11.43,7.62; D5 11.43,0; D6 11.43,-2.54; D7 11.43,-5.08; D8 11.43,-7.62; EN -11.43,-10.16; GND@0 -11.43,-5.08; GND@1 -11.43,-15.24; GND@2 11.43,2.54; GND@3 11.43,-15.24; RST -11.43,-12.7; RSV@0 -11.43,15.24; RSV@1 -11.43,12.7; RX 11.43,-10.16; SD0 -11.43,0; SD1 -11.43,5.08; SD2 -11.43,7.62; SD3 -11.43,10.16; TX 11.43,-12.7; VIN -11.43,-17.78
TEENSY_3.5/3.6_BASIC = drill 0.965: 0/RX -25.4,-7.62; 1/TX -22.86,-7.62; 2 -20.32,-7.62; 3/CANTX -17.78,-7.62; 3V3 7.62,-7.62; 3V3_LO -22.86,7.62; 4/CANRX -15.24,-7.62; 5 -12.7,-7.62; 6 -10.16,-7.62; 7 -7.62,-7.62; 8 -5.08,-7.62; 9/CS -2.54,-7.62; 10/CS 0,-7.62; 11/MOSI 2.54,-7.62; 12/MISO 5.08,-7.62; 13/SCK 5.08,7.62; 14/A0 2.54,7.62; 15/A1 0,7.62; 16/A2 -2.54,7.62; 17/A3 -5.08,7.62; 18/A4/SDA -7.62,7.62; 19/A5/SCL -10.16,7.62; 20/A6 -12.7,7.62; 21/A7 -15.24,7.62; 21/DAC0 12.7,7.62; 22/A8 -17.78,7.62; 23/A9 -20.32,7.62; 24 10.16,-7.62; 25 12.7,-7.62; 26 15.24,-7.62; 27 17.78,-7.62; 28 20.32,-7.62; 29 22.86,-7.62; 30 25.4,-7.62; 31/A12 27.94,-7.62; 32/A13 30.48,-7.62; 33/A14 30.48,7.62; 34/A15 27.94,7.62; 35/A16 25.4,7.62; 36/A17 22.86,7.62; 37/A18 20.32,7.62; 38/A19 17.78,7.62; 39/A20 15.24,7.62; A10 -17.78,5.08; A11 -15.24,5.08; A22/DAC1 10.16,7.62; AGND -25.4,7.62; AREF -20.32,5.08; GND -27.94,-7.62; GND2 7.62,7.62; VIN -27.94,7.62; VUSB -25.4,5.08
SOT223 = smd 1.219 x 2.235: 1 -2.311,-3.099; 2 0,-3.099; 3 2.311,-3.099 | smd 3.6 x 2.2: 4 0,3.099
W237-6P = drill 1.194 long: 1 -12.7,-0.635; 2 -7.62,-0.635; 3 -2.54,-0.635; 4 2.54,-0.635; 5 7.62,-0.635; 6 12.7,-0.635

### Placement (x,y rotation side)
12V  125.49,93.94 0 top
12V1  151.83,61.76 0 top
7805  99.18,71.18 270 top
C1  57.14,66.88 180 top
C2  57.14,72.88 180 top
C3  57.14,78.88 180 top
C4  61.91,58.75 180 bottom
C5  57.37,54.25 90 bottom
C6  65.52,43.25 270 bottom
C7  45.58,25.08 315 top
C10  83.72,6.55 0 bottom
C11  99.71,8.15 180 bottom
C12  106.14,82.98 180 top
C13  106.14,75.28 180 top
C14  92.9,67.23 270 bottom
C15  85.03,70.03 0 bottom
C16  84.97,57.45 0 bottom
C_V  18.38,47.8 270 top
D1  15.23,92.64 180 top
D2  68.9,104.58 270 top
D3  101.49,12.41 0 bottom
D5  125.23,80.93 0 top
D6  89.93,104.58 270 top
D7  83.39,2.25 180 bottom
D8  21.39,56.09 0 top
DRIBBLER  98.94,104.58 0 top
DRIBBLER_NMOS  98.85,94.05 0 bottom
EX-12V  79.82,104.58 180 top
FUSE  123.62,74.39 180 top
GT_DRIVER  46.71,82.37 180 bottom
IC2  85.12,79.81 0 bottom
IGBT  68.06,73.15 90 top
IRF4905  125.49,86.97 180 top
JP1  105.56,67.57 0 top
JP2  64.11,33.76 90 top
JP3  97.34,50.53 90 top
JP4  68.63,24.94 270 top
JP5  151.99,68.55 0 top
M1  140.34,80.08 90 top
M2  14.34,77.08 90 top
M3  26.34,77.08 90 top
M4  152.34,80.08 90 top
MEDIA  97.34,31.41 90 top
OPAMP  64.42,9.01 180 top
PWM2  125.52,63.95 0 top
PWM-1  41.2,64.03 0 top
Q1  54.87,35.73 180 bottom
Q2  41,79.91 270 top
Q3  30.83,35.65 0 bottom
R1  54.23,54.18 270 bottom
R2  64.19,52.98 90 bottom
R3  69.53,43.24 90 bottom
R4  51.26,49.35 0 bottom
R5  51.26,46.05 0 bottom
R6  60.75,40.7 90 bottom
R8  122.68,29.02 180 top
R9  68.96,94.3 270 bottom
R10  48.68,69.67 90 bottom
R11  53.2,90.19 180 bottom
R12  54.88,16.86 270 bottom
R13  45.22,69.68 90 bottom
R14  46.87,90.25 180 bottom
R15  122.75,20.01 270 top
R16  117.92,22.55 270 top
R17  134.07,89.45 0 bottom
R18  90.57,94.17 90 bottom
R19  98.89,80.96 0 bottom
R20  70.13,48.19 0 bottom
R21  67.76,52.98 270 bottom
R22  83.9,78.41 180 top
R23  83.92,75.08 180 top
R24  80.5,49.11 270 top
R25  98.9,84.23 0 bottom
R26  53.44,12.34 0 bottom
R27  24.13,38.95 225 bottom
R28  23.56,44.79 0 bottom
R29  23.59,48.05 0 bottom
R30  23.58,51.22 0 bottom
S2  21.63,36.04 225 top
SOLENOID  13.87,99.18 0 top
SW-CON  144.31,53.81 90 top
SWITCH  80.71,92.02 270 top
T1  40.6,50.74 0 top
U1  59.31,48.17 0 bottom
U2  86.86,73.74 0 top
U$1  153.06,90.78 90 top
U$2  116.08,34.12 0 top
U$3  83.56,30.14 90 top
VBAT  138.07,32.86 90 top
VBAT2  133.4,44 0 top
VREG3.3  84.94,63.37 180 bottom
VT_D  67.2,65.62 90 top
X1  41.17,104.58 0 top
X2  125.5,104.58 0 top

### Tracks (layer width: path | path; a pad name or v marks a point on that pad's centre or on a via)
1A
  Top 0.305: PWM2.1 119.14,63.98 87.19,63.98 85.27,62.06 85.27,15.15 88.06,12.36 U$3.3/CANTX
1B
  Top 0.305: U$3.4/CANRX 87.76,14.9 86.04,16.62 86.04,61.71 87.59,63.26 114.16,63.26 116.34,61.08 120.34,61.08 121.71,62.46 PWM2.2
2A
  Bottom 0.305: PWM-1.1 34.85,46.19 63.58,17.47 75.91,17.47 U$3.20/A6
2B
  Bottom 0.305: PWM-1.2 37.39,65.48 36.36,66.51 34.03,66.51 32.94,65.43 32.94,46.47 64.5,14.9 U$3.21/A7
3A
  Top 0.305: PWM-1.5 45.01,41.25 73.9,12.36 U$3.22/A8
3B
  Top 0.305: PWM-1.6 47.55,65.84 46.63,66.76 44.66,66.76 43.74,65.84 43.74,40.31 74.22,9.82 U$3.23/A9
4A
  Top 0.305: PWM2.5 129.33,62.09 129.34,62.08 127.65,60.39 115.92,60.39 113.8,62.51 87.76,62.51 86.74,61.48 86.74,20.01 89.31,17.44 U$3.5
4B
  Top 0.305: PWM2.6 131.87,61.62 129.89,59.63 115.79,59.63 113.59,61.84 88.09,61.84 87.54,61.28 87.54,21.88 89.44,19.98 U$3.6
+3V3
  Bottom 0.406: VREG3.3.4 84.75,60.08 82.06,60.08 79.55,62.58 71.59,62.58 64.19,55.18 R2.2
  Bottom 0.813: VREG3.3.2 VREG3.3.4 86.37,58.85 C16.1
+5V
  Top 0.813: U2.VCC 82.79,82.63 85.3,80.12 R22.1 85.32,78.4 R23.1 91.75,68.64 7805.OUT | MEDIA.3 95.8,32.68 94.52,33.96 94.52,46.09 96.42,47.99 JP3.1
  Top 1.27: JP1.3 JP1.2 JP1.1 101.95,68.64 7805.OUT | JP3.3 JP3.2 JP3.1
  Bottom 0.305: OPAMP.7 65.69,5.87 68.39,8.57 83.99,8.57 85.12,7.44 C10.1
  Bottom 0.508: C11.1 98.31,7.12 94.68,3.49 88.97,3.49 87.56,2.08 86.73,2.08 D7.A
  Bottom 0.813: MEDIA.3 98.83,32.68 100.57,30.93 100.57,23.11 98.32,20.86 D3.A C11.1 | C10.1 86.34,5.32 86.34,2.47 D7.A
  Bottom 1.27: C14.1 7805.OUT | JP1.1 103.02,57.15 98.94,53.07 JP3.3
+12V
  Top 2: D5.C 122.95,83.73 IRF4905.S 113.77,89.51 107.26,83 C12.+ | 12V.1 12V.2 12V.3 | C12.+ C13.+ 107.41,73.77 105.3,71.66 102.26,71.66 100.2,73.72 7805.IN | C12.+ 107.41,94.76 101.52,100.65 DRIBBLER.2 101.48,102.22 98.34,99.08 81.8,99.08 | X1.3 38.63,101.79 41.34,99.08 81.8,99.08 | EX-12V.1 81.8,99.08
  Bottom 0.61: EX-12V.1 81.8,101.63 87.86,95.57 R18.2
  Bottom 0.813: VREG3.3.3 87.25,69.21 C15.1 87.42,71.02 87.42,73.72
  Bottom 1.27: 12V1.3 155.43,61.76 157.41,63.74 157.41,86.03 153.34,90.1 153.34,95.08 153.14,95.28 152.54,95.28
  Bottom 2: X2.3 12V.1 IRF4905.S | 12V.3 151.2,93.94 152.54,95.28 U$1.+ | IC2.2 IC2.1 87.42,73.72 7805.IN | 12V1.1 12V1.2 12V1.3
CAP+
  Top 2: C7.+ 35.62,28.68 18.38,45.91 C_V.2 C_V.1 17.69,49.76 D8.C 17.69,59.73 9.38,68.04 9.38,84.93 17.09,92.64 18.73,92.64 | D1.C 18.73,92.64 | SOLENOID.2 16.41,94.95 18.73,92.64
  Bottom 0.813: C7.+ 41.98,19.44 49.08,12.34 R26.2
  Bottom 1.016: R30.2 R29.2 | R29.2 22.19,44.81 R28.2 | C_V.2 22.19,46.53 R29.2
  pour Top: 15.94,44.83 15.94,59.96 20.8,59.96 20.8,44.83
CAP_ADC
  Top 0.305: R24.2 80.5,8.69 77.84,6.04 70.96,6.04 65.69,11.3 OPAMP.2
  Bottom 0.813: OPAMP.2 65.69,9.43 63.15,6.89 OPAMP.6
CAP_RAW
  Bottom 0.813: R12.2 54.84,15.42 R26.1 55.98,12.34 57.43,10.88 62.19,10.88 63.15,11.84 OPAMP.3
CHARGE
  Bottom 0.254: U1.3 R20.2 68.73,46.71 69.59,45.85 69.59,44.78 | 69.59,44.78 69.59,44.7 R3.2 | JP4.1 70.46,26.21 71.96,27.7 71.96,43.7 70.88,44.78 69.59,44.78
DONE
  Bottom 0.254: R21.2 R2.1 64.19,50.12 62.75,48.68 U1.2
DRAIN
  Bottom 2: DRIBBLER_NMOS.3 98.85,96.42 96.4,98.87 DRIBBLER.1
DRIBBLER
  Bottom 0.305: U$3.35/A16 77.88,55.54 79.11,54.31 92.96,54.31 100.25,61.6 100.25,77.02 97.49,79.78 R19.2
ESP_EN
  Top 0.305: U$3.2 105.08,9.82 115.34,20.08 115.34,25.08 119.3,29.04 121.26,29.04 R8.2
ESP_RX
  Top 0.305: U$2.RX 127.5,23.95 R16.1
ESP_TX
  Top 0.305: R15.1 U$2.TX
GATE
  Bottom 0.254: U1.7 55.71,47.67 54.34,46.29 54.34,44.48 52.59,42.74 Q1.1
GND  (via drill 1)
  Top 1.016: v31.34,26.08 35.93,21.49 C7.-
  Top 1.27: T1.12 52.76,56.99 55.87,60.1 C1.-
  Bottom 0.254: U1.5 62.47,47.18 63.07,46.59 63.07,42.73 63.94,41.85 C6.2 | C6.2 R3.1 | R6.1 64.56,39.3 65.52,40.26 C6.2 | R1.1 57.31,55.58 C5.2
  Bottom 0.305: R25.2 96.57,85.17 DRIBBLER_NMOS.2
  Bottom 0.406: C4.2 65.97,58.75 72.17,64.95 72.17,81.25 69.34,84.08 68.09,84.08 IGBT.3
  Bottom 1.016: S2.1 26.13,31.54 Q3.3 28.55,28.87 v31.34,26.08
  Bottom 1.27: C7.- 52.4,18.26 R12.1 56.16,18.26 60.61,13.81 OPAMP.4
  Bottom 2: R3.1 69.53,38.27 66.29,35.03 JP2.2 JP2.1
  pour Bottom (rank 4): 52.8,54.08 58.58,54.08 58.58,46.56 62.71,46.56 62.71,40.12 71.36,40.12 71.36,42.7 63.35,42.7 63.35,47.39 59.33,47.39 59.33,56.84 52.8,56.84
  pour Bottom (isolate 0.406, rank 5): 1.34,62.08 74.34,62.08 74.34,36.08 74.34,-3.92 170.34,-3.92 170.34,111.08 -0.66,111.08 -0.66,62.08
  pour Top (isolate 0.406, rank 5): -3.34,61.63 47.34,61.63 47.34,56.08 54.34,56.08 54.34,25.08 45.34,25.08 45.34,-7.92 176.34,-7.92 176.34,117.08 -3.34,117.08
INT
  Top 0.305: U2.INT 75.85,64.85 73.68,62.69 73.68,26.13 74.75,25.06 U$3.17/A3
MD-RX
  Top 0.305: U$3.10/CS 97.31,30.14 MEDIA.2
MD-TX
  Top 0.305: U$3.9/CS MEDIA.1
N$2
  Bottom 0.406: S2.2 22.24,36.65 22.24,39.04 R27.1
N$3
  Bottom 0.406: R27.2 25.96,37.12 25.96,35.33 27.41,33.87 32.55,33.87 33.11,33.31 Q3.1
N$4
  Top 2: T1.1 25.99,56.99 D8.A
N$7
  Bottom 0.61: R9.1 66.01,98.65 66.01,103.85 68.01,105.85 D2.A
N$8  (via drill 0.4)
  Top 0.406: Q2.1 v38.45,70.18 v38.46,70.17 | IGBT.1 67.99,73.08 64.68,73.08 61.33,69.73 52.28,69.73 v52.25,69.7
  Bottom 0.406: v38.46,70.17 v38.47,70.17 40.36,68.28 R13.1 45.23,68.27 R10.1 50.82,68.27 v52.25,69.7
N$9
  Bottom 0.406: GT_DRIVER.6 47.98,71.77 R10.2
N$10
  Top 2: D1.A 11.33,93.82 SOLENOID.1 11.33,100.09 13.72,102.48 20.4,102.48 40.13,82.75 Q2.2 63.92,82.75 IGBT.2
N$11
  Bottom 0.406: GT_DRIVER.2 45.44,90.22 R14.1 45.47,91.71 46.58,92.83 50.6,92.83 51.8,91.62 R11.1
N$13
  Bottom 1.27: X1.5 48.79,102.53 29.69,83.43 M3.1
N$14
  Top 0.305: R8.1 124.1,29.04 U$2.D7
N$15
  Bottom 1.27: M3.2 31.56,80.89 53.87,103.2 X1.6
N$16
  Bottom 1.27: M2.2 18.88,80.89 33.55,95.56 X1.2
N$17
  Bottom 1.27: X1.1 28.47,94.21 17.69,83.43 M2.1
N$19
  Top 0.305: U$3.0/RX 104.17,4.74 118.04,18.61 R15.2
N$20
  Top 0.305: U$3.1/TX 105.16,7.28 117.92,20.04 R16.2
N$23
  Bottom 1.016: R30.1 R29.1 24.99,44.81 R28.1 24.96,42.58 29.61,37.94 Q3.2
N$24
  Top 2: FUSE.2 118.83,74.39 125.49,81.05 IRF4905.D
N$25
  Top 2: IRF4905.G 128.03,83.21 D5.A
  Bottom 0.406: IRF4905.G 132.61,89.51 R17.2
N$26
  Bottom 0.61: R18.1 92.08,92.77 93.02,93.71 93.02,104.41 91.58,105.85 D6.A
N$27
  Bottom 0.305: DRIBBLER_NMOS.1 101.13,85.06 R25.1 100.3,80.98 R19.1
N$29
  Top 1.27: X2.5 133.12,100.68 147.36,86.43 M4.1
N$30
  Top 1.27: X2.6 138.2,100.92 149.09,90.03 154.86,90.03 156.8,88.09 156.8,85.68 155.01,83.89 M4.2
N$31
  Top 1.27: X2.1 112.8,101.9 115.61,99.08 127.21,99.08 131.67,94.62 131.67,94.56 139.79,86.43 M1.1
N$33
  Bottom 0.305: R20.1 71.8,47.92 U$3.38/A19
N$34
  Bottom 0.254: R21.1 68.92,54.38 70.12,53.18 70.12,47.3 72.03,45.38 U$3.39/A20 72.8,45.38 72.8,25.55 70.91,23.67 JP4.2
N$35
  Top 0.305: U$3.37/A18 80.46,50.46 R24.1
N$36
  Bottom 0.813: D3.C 104.66,16.33 U$2.VIN
N$70
  Bottom 1.27: M1.2 121.37,83.89 117.88,87.38 X2.2
N$72
  Top 2: SW-CON.2 141.1,55.79 134.88,62.02 FUSE.1
N$75
  Bottom 0.813: D7.C 80.18,2.2 U$3.VIN
RDCM
  Bottom 0.254: U1.8 55.19,48.17 53.07,46.05 R5.1
RGB
  Bottom 0.254: R1.2 54.3,52.85 C5.1 57.68,52.54 57.68,49.16 U1.10
RVOUT
  Bottom 0.254: U1.9 54.02,48.68 53.35,49.35 R4.1
SCL
  Top 0.305: U2.SCL 76.07,77.55 71.95,73.44 71.95,23.48 75.45,19.98 U$3.19/A5/SCL
  Top 0.813: U2.SCL 81.64,77.55 R22.2
SDA
  Top 0.305: U$3.18/A4/SDA 75.9,22.49 74.38,22.49 72.8,24.07 72.8,72.77 75.13,75.1 77.88,75.1 U2.SDA
  Top 0.813: U2.SDA 82.45,75.01 R23.2
SINK  (via drill 1)
  Top 1.016: T1.7 T1.8 T1.9 T1.10 47.5,51.99 47.48,51.97 v47.44,52
  Bottom 1.016: Q1.3 51.69,35.73 49.86,37.56 R5.2 R4.2 48.44,49.35 47.44,50.35 v47.44,52
  pour Top: 52.33,53.09 52.34,53.08 53.06,53.08 53.06,42.79 46.38,42.79 46.38,53.09
  pour Bottom (isolate 0.254): 46.34,53.08 46.34,37.08 51.34,32.08 58.34,32.08 58.34,39.08 58.34,40.08 51.34,40.08 51.34,53.08
SOL_TRIG  (via drill 0.4)
  Top 0.305: v57.6,90.19 66.76,90.19 70.84,86.1 v70.84,55.56 v70.85,55.55
  Bottom 0.305: R11.2 57.59,90.19 v57.6,90.19 | v70.85,55.55 73.39,53 U$3.36/A17
SOURCE
  Bottom 0.254: U1.6 56.45,47.18 56.19,46.92 56.19,44.42 57.34,43.27 57.34,42.32 Q1.2
  Bottom 1.016: Q1.2 60.72,42.13 R6.2
  pour Bottom (isolate 0.254): 58.12,46.03 58.12,43.48 62.34,43.48 62.34,40.68 55.62,40.68 55.62,46.03
VBAT+
  Top 2: VBAT.1 136.36,30.32 133.83,32.85 133.83,41.57 136.3,44.04 137.85,44.04 VBAT2.+ 137.9,47.64 142.09,51.83 SW-CON.1
VIN
  Bottom 2: SWITCH.2 SWITCH.5 80.71,86.95 85.12,82.54 IC2.3
VTRANS  (via drill 2)
  Top 2: T1.6 T1.5 T1.4 T1.3 36.17,51.99 39.11,54.93 v38.98,55.05
  Bottom 0.254: 60.85,49.16 60.56,49.16 60.26,48.87 60.26,47.91 60.51,47.67 U1.4 63.93,47.67 65.52,46.08 C6.1
  Bottom 0.305: U1.1 60.85,49.16 60.51,49.5 C4.1
  Bottom 0.61: R9.2 75.18,92.9 SWITCH.3 | S2.3 14.16,43.51 14.16,60.9 21.82,68.56 34.51,68.56 42.88,76.92 42.88,77.9 GT_DRIVER.8
  Bottom 1.016: GT_DRIVER.8 42.9,79.23 45.28,81.61 58.41,81.61 C3.+
  Bottom 1.27: C1.+ 60.51,65.36 C4.1
  Bottom 2: v38.98,55.05 42.7,58.77 60.5,58.77 C4.1 | SWITCH.3 SWITCH.6 63.89,89.64 58.41,84.15 C3.+ 58.41,73.15 | 58.41,73.15 58.34,73.08 58.34,72.95 C2.+ | 58.41,73.15 C1.+ VT_D.2 VT_D.1
  pour Top: 28.34,53.08 28.34,43.08 32.34,43.08 33.34,43.08 33.34,53.08 33.34,53.5 28.77,53.5 28.34,53.5
  pour Bottom (isolate 0.254): 63.71,94.08 73.34,94.08 73.34,97.08 78.76,97.08 78.76,87.08 61.97,87.08 61.97,49.05 59.8,49.02 59.87,57.42 43.34,57.42 43.34,50.97 36.01,50.97 36.01,60.79 57.16,60.79 57.16,87.53
  pour Bottom (isolate 0.254): 63.84,43.08 63.84,47.42 63.84,47.91 67.34,47.91 67.34,43.08

### Text on the board
tPlace: GND | +12V | * | Soccer PCB / Mar 25 2020 / Ver 4.1 | Designer: / Abinav A. / InspiredAFT. | Caution: / HIGH Voltage / Do Not Touch | ON | GND | GND | OFF | D C | TX
tNames: M1A M1B 12V GND M2A M2B | M1A M1B 12V GND M2A M2B | 1A 1B 5V GND 2A 2B | 1A 1B 5V GND 2A 2B | GND | V+